# Altium schematic sheet overall.SchDoc
size A
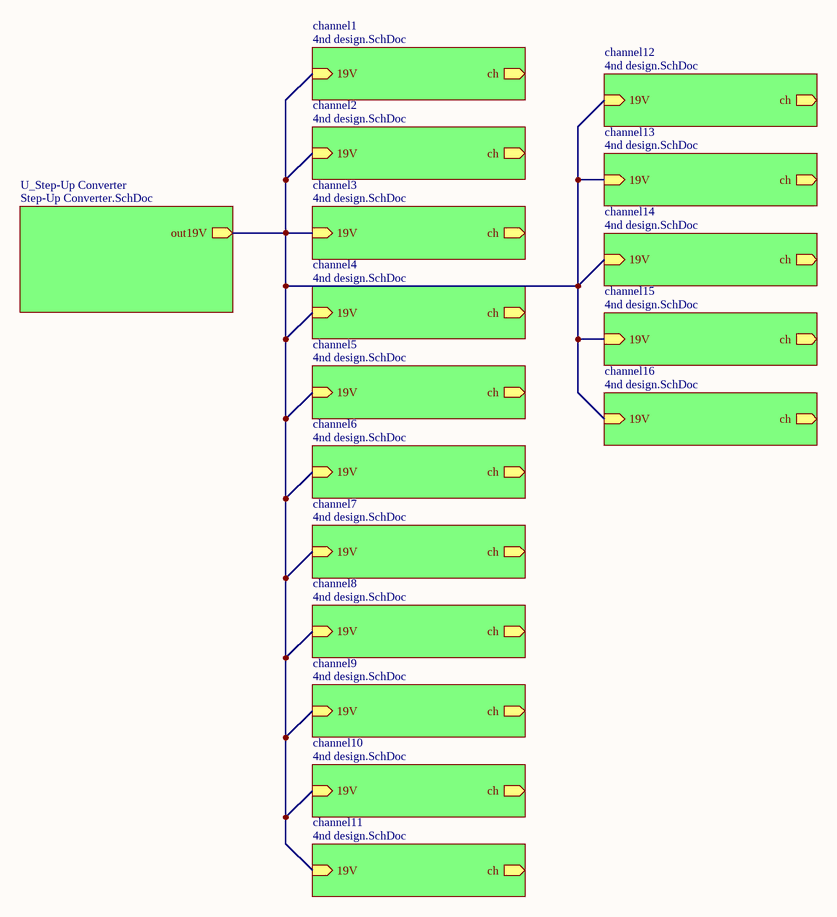
[diagram p0: overall.SchDoc]

## Sub-sheets
channel1 = 4nd design.SchDoc: 19V (in), ch (out)
channel2 = 4nd design.SchDoc: 19V (in), ch (out)
channel3 = 4nd design.SchDoc: 19V (in), ch (out)
channel4 = 4nd design.SchDoc: 19V (in), ch (out)
channel5 = 4nd design.SchDoc: 19V (in), ch (out)
channel6 = 4nd design.SchDoc: 19V (in), ch (out)
channel7 = 4nd design.SchDoc: 19V (in), ch (out)
channel8 = 4nd design.SchDoc: 19V (in), ch (out)
channel9 = 4nd design.SchDoc: 19V (in), ch (out)
channel10 = 4nd design.SchDoc: 19V (in), ch (out)
channel11 = 4nd design.SchDoc: 19V (in), ch (out)
channel12 = 4nd design.SchDoc: 19V (in), ch (out)
channel13 = 4nd design.SchDoc: 19V (in), ch (out)
channel14 = 4nd design.SchDoc: 19V (in), ch (out)
channel15 = 4nd design.SchDoc: 19V (in), ch (out)
channel16 = 4nd design.SchDoc: 19V (in), ch (out)
U_Step-Up Converter = Step-Up Converter.SchDoc: out19V (out)

## Nets
(unnamed): sheet U_Step-Up Converter/out19V, sheet channel1/19V, sheet channel2/19V, sheet channel3/19V, sheet channel4/19V, sheet channel5/19V, sheet channel6/19V, sheet channel7/19V, sheet channel8/19V, sheet channel9/19V, sheet channel10/19V, sheet channel11/19V, sheet channel12/19V, sheet channel13/19V, sheet channel14/19V, sheet channel15/19V, sheet channel16/19V